# EAGLE design ByteBlaster (EAGLE 6.6.0)
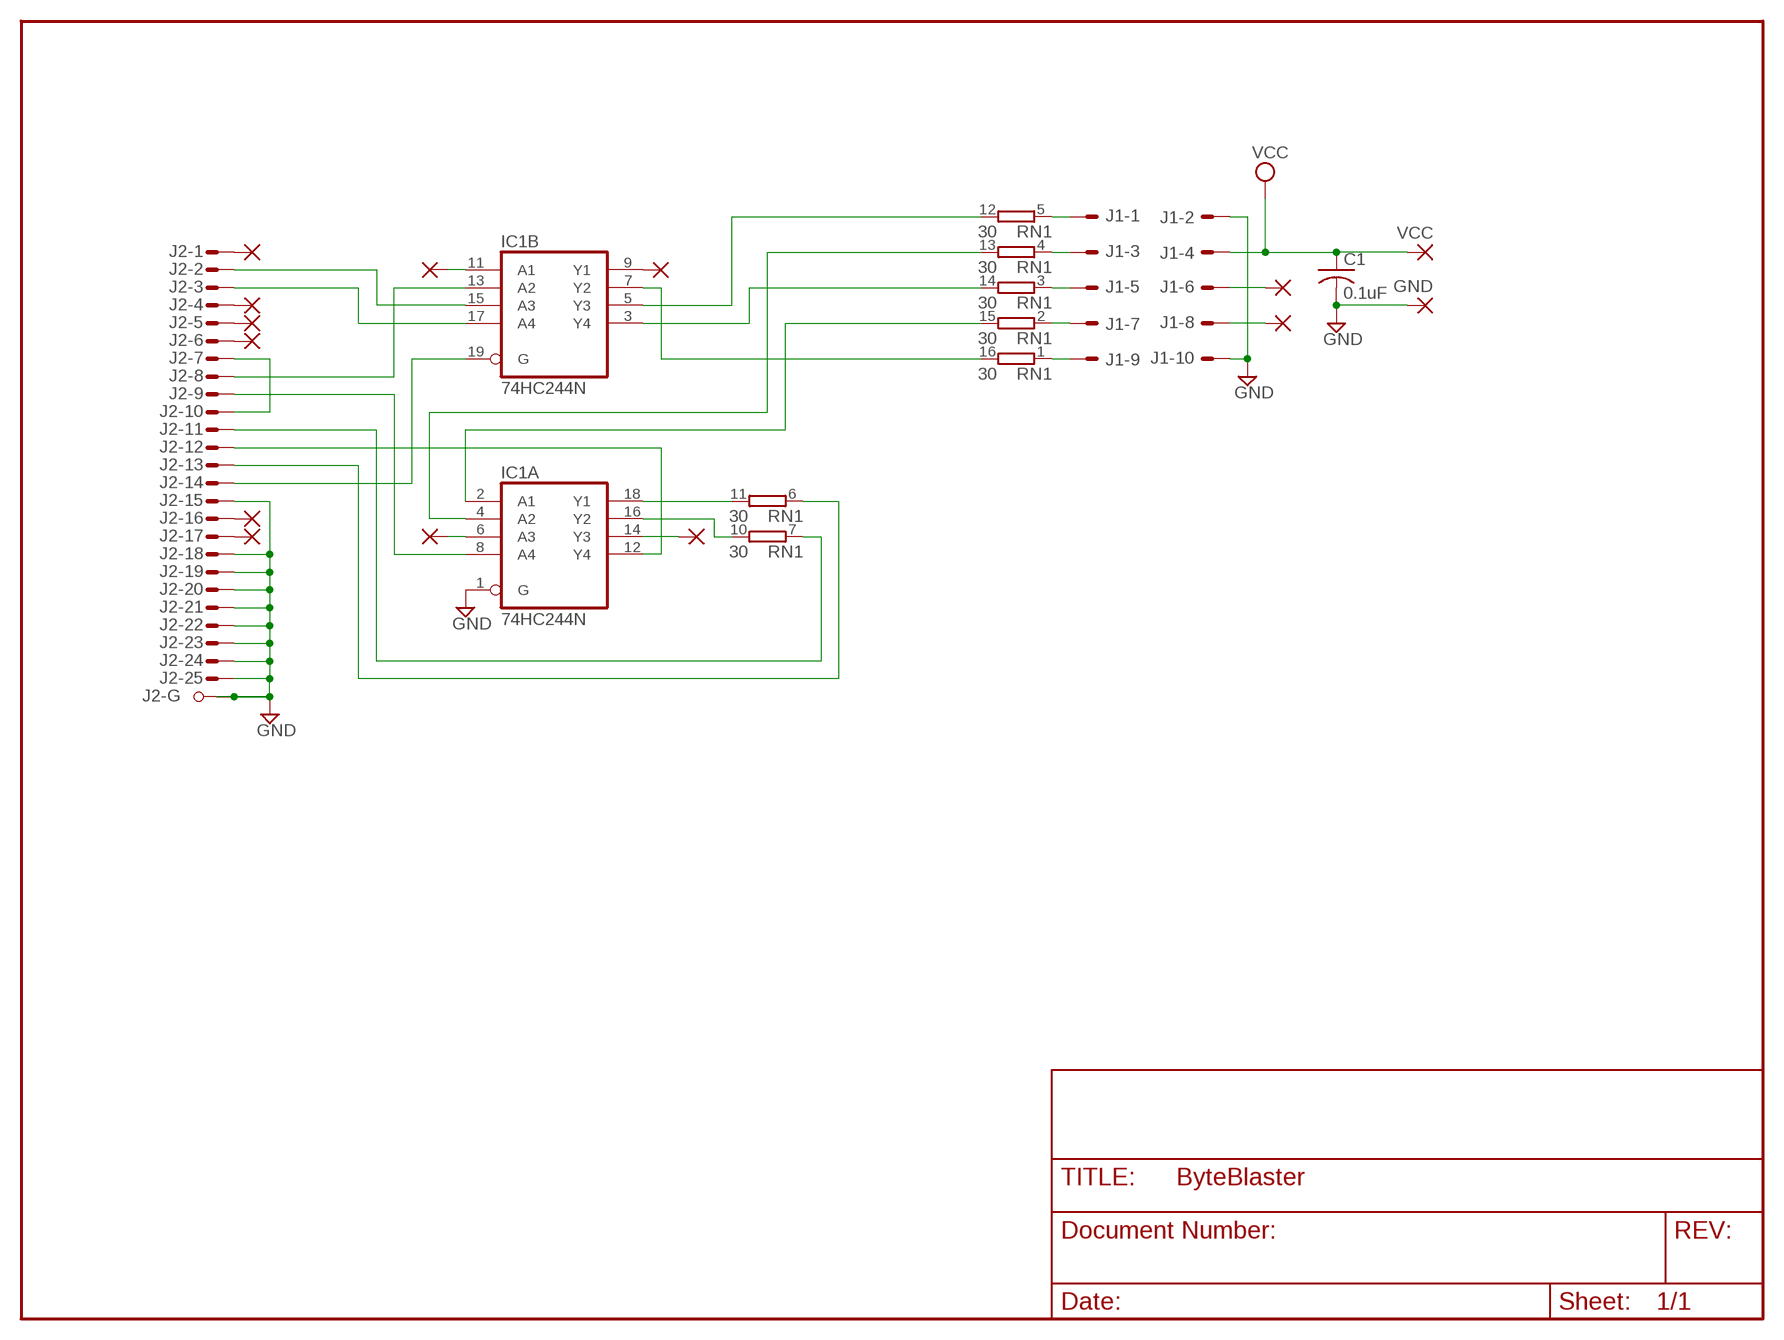
[diagram p0: schematic, sheet 1]

## Parts
C1  0.1uF  C-US050-025X075  [C050-025X075]
GND  1,6/0,9  [1,6/0,9]
IC1  74HC244N  [DIL20]
J1  ML10E  [ML10]
J2  M25VPS  [M25VP]
PAD1  1,6/0,9  [1,6/0,9]
PAD2  1,6/0,9  [1,6/0,9]
PAD3  1,6/0,9  [1,6/0,9]
PAD4  1,6/0,9  [1,6/0,9]
PAD5  1,6/0,9  [1,6/0,9]
PAD6  1,6/0,9  [1,6/0,9]
PAD7  1,6/0,9  [1,6/0,9]
PAD8  1,6/0,9  [1,6/0,9]
PAD9  1,6/0,9  [1,6/0,9]
PAD10  1,6/0,9  [1,6/0,9]
PAD11  1,6/0,9  [1,6/0,9]
PAD12  1,6/0,9  [1,6/0,9]
RN1  30  8R-P  [DIL16]
VCC  1,6/0,9  [1,6/0,9]

## Nets
GND [supply]: C1.2 GND.1(P) IC1.1(A:G) J1.2 J1.10 J2.15(-15:M) J2.18(-18:M) J2.19(-19:M) J2.20(-20:M) J2.21(-21:M) J2.22(-22:M) J2.23(-23:M) J2.24(-24:M) J2.25(-25:M) J2.G1(-G:G1) J2.G2(-G:G2)
N$1: J2.1(-1:M) PAD1.1(P)
N$2: J2.16(-16:M) PAD5.1(P)
N$3: J2.4(-4:M) PAD2.1(P)
N$4: J2.5(-5:M) PAD3.1(P)
N$5: J2.6(-6:M) PAD4.1(P)
N$6: J2.17(-17:M) PAD6.1(P)
N$7: IC1.15(B:A3) J2.2(-2:M)
N$8: IC1.17(B:A4) J2.3(-3:M)
N$9: J2.7(-7:M) J2.10(-10:M)
N$10: IC1.13(B:A2) J2.8(-8:M)
N$11: IC1.8(A:A4) J2.9(-9:M)
N$12: J2.13(-13:M) RN1.6
N$13: IC1.12(A:Y4) J2.12(-12:M)
N$14: J2.11(-11:M) RN1.7
N$15: IC1.19(B:G) J2.14(-14:M)
N$16: IC1.11(B:A1) PAD7.1(P)
N$17: IC1.6(A:A3) PAD8.1(P)
N$18: IC1.5(B:Y3) RN1.12
N$19: IC1.3(B:Y4) RN1.14
N$20: J1.6 PAD9.1(P)
N$21: J1.8 PAD10.1(P)
N$22: J1.9 RN1.1
N$23: J1.7 RN1.2
N$24: J1.5 RN1.3
N$25: J1.3 RN1.4
N$26: J1.1 RN1.5
N$27: IC1.9(B:Y1) PAD11.1(P)
N$28: IC1.14(A:Y3) PAD12.1(P)
N$29: IC1.7(B:Y2) RN1.16
N$30: IC1.2(A:A1) RN1.15
N$31: IC1.16(A:Y2) RN1.10
N$32: IC1.18(A:Y1) RN1.11
N$33: IC1.4(A:A2) RN1.13
VCC [supply]: C1.1 J1.4 VCC.1(P)
Unconnected: RN1.8 RN1.9

## Power pins joined to a net without a drawn wire
GND: IC1.10(P:GND)
VCC: IC1.20(P:VCC)

## Library data of the parts
C1 = rcl:C-US: CAPACITOR, American symbol
GND PAD1-PAD12 VCC = wirepad:1,6/0,9: THROUGH-HOLE PAD
IC1 = 74xx-eu:74*244: Octal BUFFER and LINE DRIVER, 3-state
J1 = con-harting-ml:ML10?E: HARTING
J2 = con-subd:M25VPS: SUB-D
RN1 = resistor-dil:8R-P: DIL RESISTOR

## Net classes
1 supply: width 0.813 mm

## Board
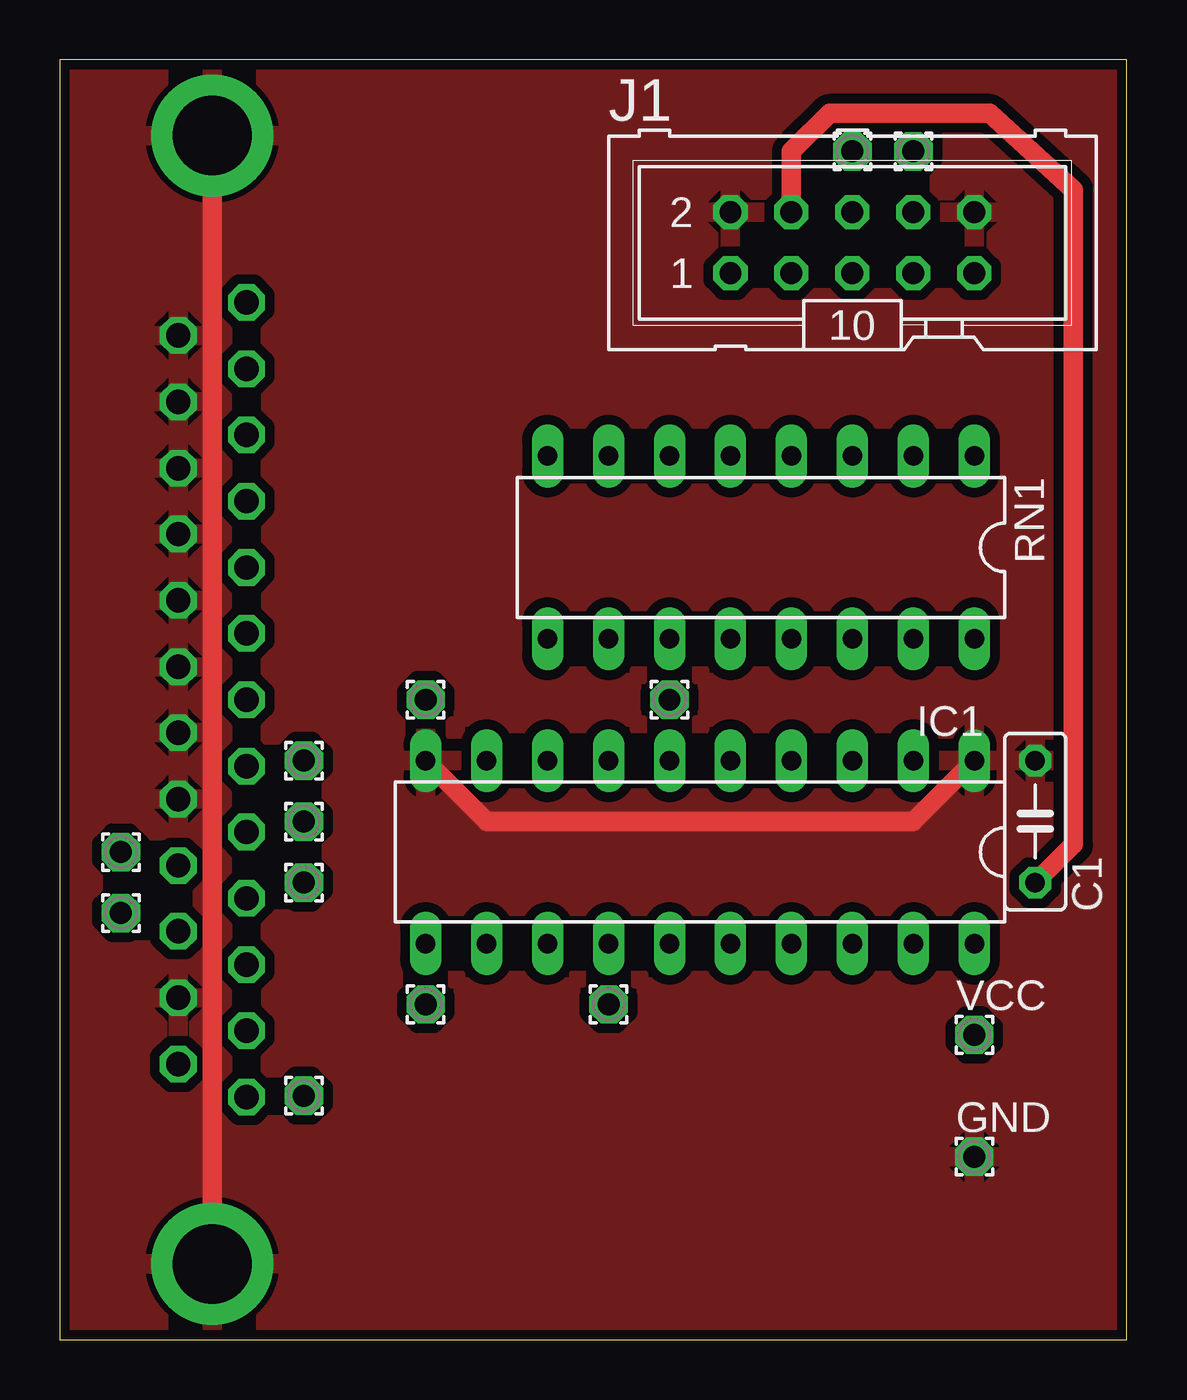
[diagram p1: board, top side]
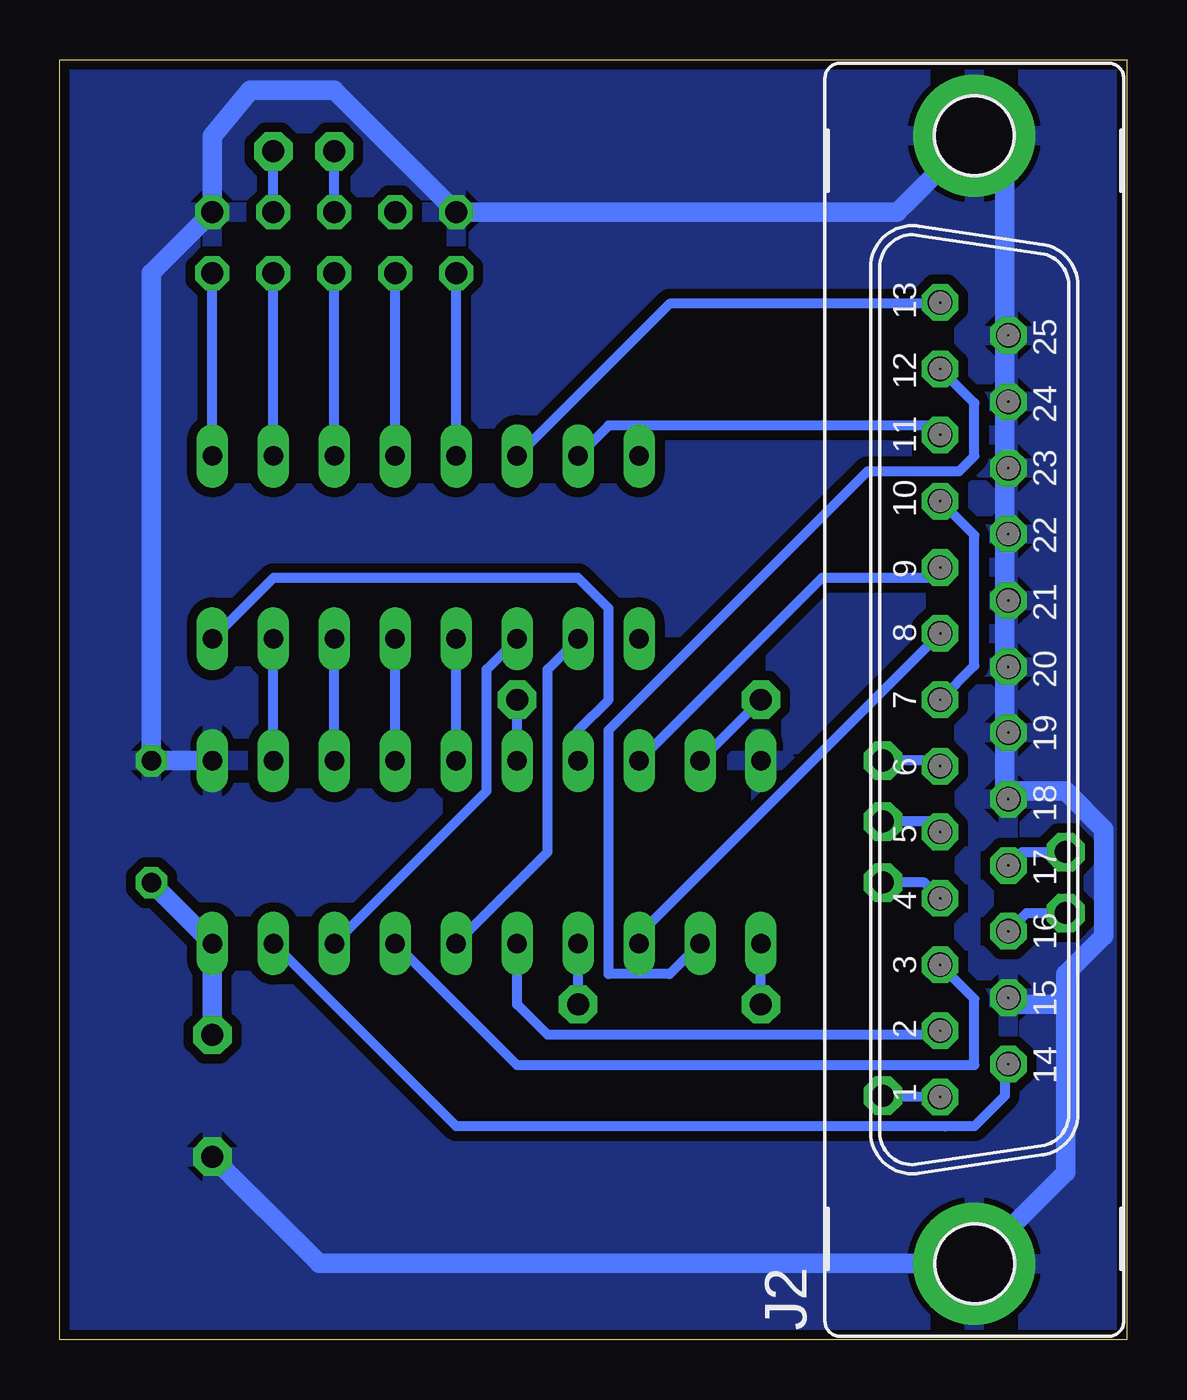
[diagram p2: board, bottom side, seen from below]

Size 44.45 x 53.34 mm. Coordinates in mm from the lower left corner, seen from the top.
Outline: 0,0 44.45,0 44.45,53.34 0,53.34 0,0
Copper layers (1+16): Top 0.035mm / dielectric 1.5mm / Bottom 0.035mm
Design rules "16mils": minimum track width 16mil, minimum drill 32mil, track to track 15mil, track to pad 10mil, pad to pad 10mil, via to via 10mil, smd to smd 10mil, copper to edge 13mil, drill to drill 10mil, minimum pad ring 10mil, minimum via ring 8mil, stop-mask expansion 0mil, vias tented up to drill 0mil, thermal gap 10mil

### Footprints (pad centres in the part's own frame; a part is rotated, then mirrored left to right if it is on the bottom)
C050-025X075 = drill 0.813 octagon: 1 -2.54,0; 2 2.54,0
1,6/0,9 = drill 0.914 pad 1.6 octagon: 1 0,0
DIL20 = drill 0.813 long: 1 -11.43,-3.81; 2 -8.89,-3.81; 3 -6.35,-3.81; 4 -3.81,-3.81; 5 -1.27,-3.81; 6 1.27,-3.81; 7 3.81,-3.81; 8 6.35,-3.81; 9 8.89,-3.81; 10 11.43,-3.81; 11 11.43,3.81; 12 8.89,3.81; 13 6.35,3.81; 14 3.81,3.81; 15 1.27,3.81; 16 -1.27,3.81; 17 -3.81,3.81; 18 -6.35,3.81; 19 -8.89,3.81; 20 -11.43,3.81
ML10 = drill 0.914 octagon: 1 -5.08,-1.27; 2 -5.08,1.27; 3 -2.54,-1.27; 4 -2.54,1.27; 5 0,-1.27; 6 0,1.27; 7 2.54,-1.27; 8 2.54,1.27; 9 5.08,-1.27; 10 5.08,1.27
M25VP = drill 1.016 octagon: 1 -16.561,1.422; 2 -13.792,1.422; 3 -11.049,1.422; 4 -8.28,1.422; 5 -5.512,1.422; 6 -2.769,1.422; 7 0,1.422; 8 2.769,1.422; 9 5.512,1.422; 10 8.28,1.422; 11 11.049,1.422; 12 13.792,1.422; 13 16.561,1.422; 14 -15.189,-1.422; 15 -12.421,-1.422; 16 -9.652,-1.422; 17 -6.909,-1.422; 18 -4.14,-1.422; 19 -1.372,-1.422; 20 1.372,-1.422; 21 4.14,-1.422; 22 6.909,-1.422; 23 9.652,-1.422; 24 12.421,-1.422; 25 15.189,-1.422 | drill 3.302 pad 5.08: G1 -23.52,0; G2 23.52,0
DIL16 = drill 0.813 long: 1 -8.89,-3.81; 2 -6.35,-3.81; 3 -3.81,-3.81; 4 -1.27,-3.81; 5 1.27,-3.81; 6 3.81,-3.81; 7 6.35,-3.81; 8 8.89,-3.81; 9 8.89,3.81; 10 6.35,3.81; 11 3.81,3.81; 12 1.27,3.81; 13 -1.27,3.81; 14 -3.81,3.81; 15 -6.35,3.81; 16 -8.89,3.81

### Placement (x,y rotation side)
C1  40.64,21.59 90 top
GND  38.1,7.62 0 top
IC1  26.67,20.32 180 top
J1  33.02,45.72 0 top
J2  6.35,26.67 90 bottom
PAD1  10.16,10.16 0 top
PAD2  10.16,19.05 0 top
PAD3  10.16,21.59 0 top
PAD4  10.16,24.13 0 top
PAD5  2.54,17.78 0 top
PAD6  2.54,20.32 0 top
PAD7  15.24,13.97 0 top
PAD8  25.4,26.67 0 top
PAD9  33.02,49.53 0 top
PAD10  35.56,49.53 0 top
PAD11  15.24,26.67 0 top
PAD12  22.86,13.97 0 top
RN1  29.21,33.02 180 top
VCC  38.1,12.7 0 top

### Tracks (layer width: path | path; a pad name or v marks a point on that pad's centre or on a via)
GND
  Top 0.813: IC1.1 35.56,21.59 17.78,21.59 IC1.10 | 6.35,3.81 6.35,49.53
  Bottom 0.813: IC1.1 C1.2 40.64,44.45 J1.10 38.1,50.16 36.51,52.07 33.02,52.07 J1.2 9.55,46.99 J2.G2 5.08,48.92 5.08,42.01 J2.25 5.08,41.71 5.08,39.24 J2.24 5.08,38.94 5.08,36.47 J2.23 5.08,36.17 5.08,33.73 J2.22 5.08,33.43 5.08,30.96 J2.21 5.08,30.66 5.08,28.19 J2.20 5.08,27.89 5.08,25.45 J2.19 5.08,25.15 5.08,22.68 J2.18 4.6,22.86 2.54,22.86 0.95,21.27 0.95,16.83 2.54,15.24 2.54,13.97 | J2.G1 2.54,6.96 2.54,13.97 | 2.54,13.97 2.54,14.08 | J2.15 4.65,13.97 2.54,13.97 | GND.1 33.66,3.17 6.67,3.17
  pour Bottom (isolate 0.406): 0,0 44.45,0 44.45,53.34 0,53.34
  pour Top (isolate 0.406): 0,0 44.45,0 44.45,53.34 0,53.34
N$1
  Bottom 0.406: J2.1 10.16,10.11 PAD1.1
N$2
  Bottom 0.406: J2.16 4.17,17.78 PAD5.1
N$3
  Bottom 0.406: J2.4 8.43,19.05 PAD2.1
N$4
  Bottom 0.406: J2.5 8.2,21.59 PAD3.1
N$5
  Bottom 0.406: J2.6 8,24.13 PAD4.1
N$6
  Bottom 0.406: J2.17 4.37,20.32 PAD6.1
N$7
  Bottom 0.406: IC1.15 25.4,13.97 24.13,12.7 7.95,12.7 J2.2
N$8
  Bottom 0.406: J2.3 6.35,14.2 6.35,11.43 25.4,11.43 IC1.17
N$9
  Bottom 0.406: J2.7 6.35,28.09 6.35,33.53 J2.10
N$10
  Bottom 0.406: J2.8 20.32,16.89 IC1.13
N$11
  Bottom 0.406: J2.9 8.2,31.75 12.7,31.75 IC1.8
N$12
  Bottom 0.406: J2.13 7.82,43.18 19.05,43.18 RN1.6
N$13
  Bottom 0.406: J2.12 6.35,39.04 6.35,36.83 6.99,36.2 10.79,36.2 21.59,25.4 21.59,15.24 19.05,15.24 IC1.12
N$14
  Bottom 0.406: J2.11 8.15,38.1 21.59,38.1 RN1.7
N$15
  Bottom 0.406: 7.62,8.89 7.52,8.89 | 7.62,8.89 27.94,8.89 IC1.19 | J2.14 5.08,11.33 5.08,10.16 6.35,8.89 7.62,8.89
N$16
  Bottom 0.406: PAD7.1 IC1.11
N$17
  Bottom 0.406: IC1.6 PAD8.1
N$18
  Bottom 0.406: IC1.5 RN1.12
N$19
  Bottom 0.406: IC1.3 RN1.14
N$20
  Bottom 0.406: J1.6 PAD9.1
N$21
  Bottom 0.406: J1.8 PAD10.1
N$22
  Bottom 0.406: RN1.1 J1.9
N$23
  Bottom 0.406: RN1.2 J1.7
N$24
  Bottom 0.406: RN1.3 J1.5
N$25
  Bottom 0.406: RN1.4 J1.3
N$26
  Bottom 0.406: RN1.5 J1.1
N$27
  Bottom 0.406: PAD11.1 IC1.9
N$28
  Bottom 0.406: PAD12.1 IC1.14
N$29
  Bottom 0.406: RN1.16 35.56,31.75 22.86,31.75 21.59,30.48 21.59,26.67 22.86,25.4 IC1.7
N$30
  Bottom 0.406: IC1.2 RN1.15
N$31
  Bottom 0.406: IC1.16 24.13,20.32 24.13,27.94 RN1.10
N$32
  Bottom 0.406: IC1.18 26.67,22.86 26.67,27.94 RN1.11
N$33
  Bottom 0.406: IC1.4 RN1.13
VCC
  Top 0.813: J1.4 30.48,49.53 32.07,51.12 38.73,51.12 42.23,47.94 42.23,20.64 C1.1
  Bottom 0.813: C1.1 IC1.20 VCC.1